# Altium schematic sheet power.SchDoc
size Letter
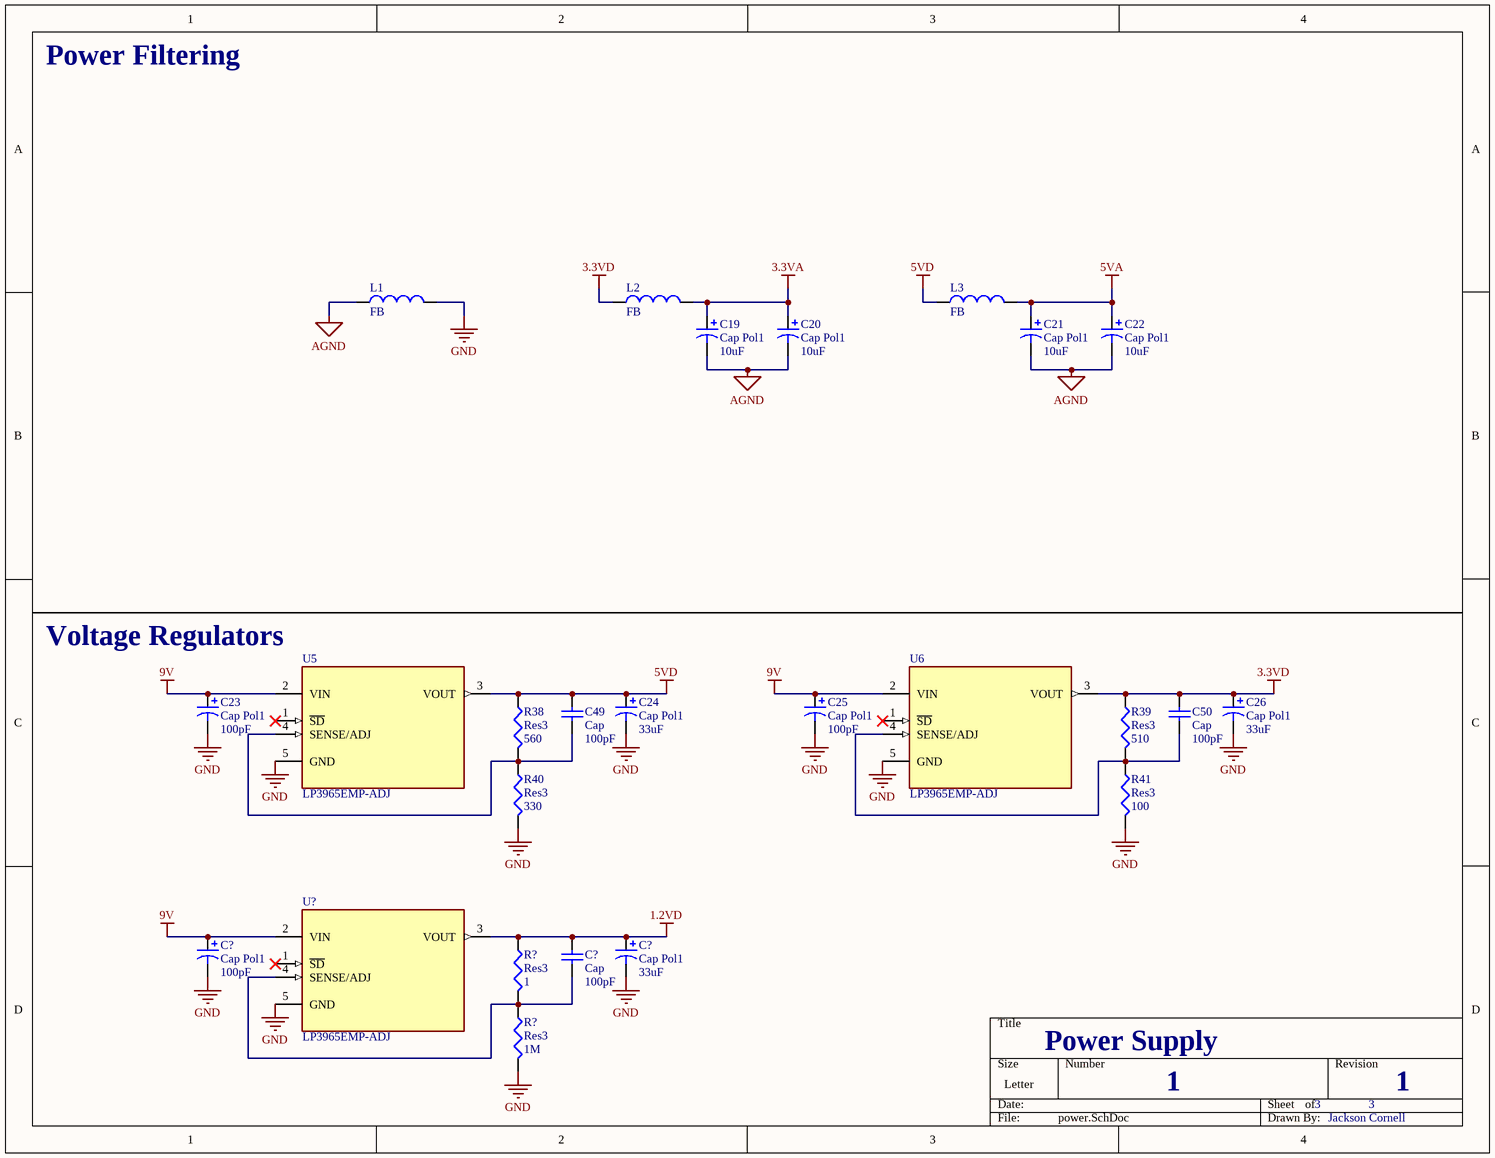
[diagram p0: power.SchDoc]

## Parts
(Parts that share a designator on the sheet are numbered #1, #2 ... from top to bottom, then left to right.)
C19  Cap Pol1  value 10uF  [RB7.6-15]
C20  Cap Pol1  value 10uF  [RB7.6-15]
C21  Cap Pol1  value 10uF  [RB7.6-15]
C22  Cap Pol1  value 10uF  [RB7.6-15]
C23  Cap Pol1  value 100pF  [RB7.6-15]
C24  Cap Pol1  value 33uF  [RB7.6-15]
C25  Cap Pol1  value 100pF  [RB7.6-15]
C26  Cap Pol1  value 33uF  [RB7.6-15]
C49  Cap  value 100pF  [CAPC0805]
C50  Cap  value 100pF  [CAPC0805]
C?#1  Cap Pol1  value 100pF  [RB7.6-15]
C?#2  Cap Pol1  value 33uF  [RB7.6-15]
C?#3  Cap  value 100pF  [CAPC0805]
L1  FB  [0402-A]
L2  FB  [0402-A]
L3  FB  [0402-A]
R38  Res3  value 560  [RES0805]
R39  Res3  value 510  [RES0805]
R40  Res3  value 330  [RES0805]
R41  Res3  value 100  [RES0805]
R?#1  Res3  value 1  [RES0805]
R?#2  Res3  value 1M  [RES0805]
U5  LP3965EMP-ADJ  [SOT150P696X180-5N]
U6  LP3965EMP-ADJ  [SOT150P696X180-5N]
U?  LP3965EMP-ADJ  [SOT150P696X180-5N]

## Nets
1.2VD: C?#2.1 C?#3.2 R?#1.1 U?.3(VOUT)
3.3VA: C19.1 C20.1 L2.2
3.3VD: C26.1 C50.2 L2.1 R39.1 U6.3(VOUT)
5VA: C21.1 C22.1 L3.2
5VD: C24.1 C49.2 L3.1 R38.1 U5.3(VOUT)
9V: C23.1 C25.1 C?#1.1 U5.2(VIN) U6.2(VIN) U?.2(VIN)
AGND: C19.2 C20.2 C21.2 C22.2 L1.1
GND: C23.2 C24.2 C25.2 C26.2 C?#1.2 C?#2.2 L1.2 R40.2 R41.2 R?#2.2 U5.5(GND) U6.5(GND) U?.5(GND)
NetC49_1: C49.1 R38.2 R40.1 U5.4(SENSE/ADJ)
NetC50_1: C50.1 R39.2 R41.1 U6.4(SENSE/ADJ)
NetC?#3_1: C?#3.1 R?#1.2 R?#2.1 U?.4(SENSE/ADJ)

Not connected (* = marked no-connect by the designer): U5 1(~{SD})*; U6 1(~{SD})*; U? 1(~{SD})*

## Notes on the sheet
- Power Filtering
- Voltage Regulators
- Power Supply
- 1
- 3
- Jackson Cornell

## Library data of the parts
C19-C26 C?#1 C?#2 = Cap Pol1: Polarized Capacitor (Radial); Published: 8-Jun-2000; LatestRevisionDate: 17-Jul-2002; LatestRevisionNote: Re-released for DXP Platform.; PackageReference: RB7.6-15; Publisher: Altium Limited; PackageDescription: Polarized Capacitor (Radial); 2 Leads
C49 C50 C?#3 = Cap: Capacitor; Published: 8-Jun-2000; LatestRevisionDate: 17-Jul-2002; LatestRevisionNote: Re-released for DXP Platform.; PackageReference: RAD-0.3; Publisher: Altium Limited; PackageDescription: Radial Cap, Thru-Hole; 2 Leads; 0.3 in Pin Spacing
L1-L3 = Inductor: Code_IEC: 1005; Published: 8-Jun-2000; LatestRevisionDate: 29-May-2009; LatestRevisionNote: IPC-7351 Footprint Added.; PackageReference: 0402-A; Publisher: Altium Limited; PackageDescription: Chip Inductor; Code_JEITA: 0402
R38-R41 R?#1 R?#2 = Res3: Resistor; Published: 8-Jun-2000; LatestRevisionDate: 29-May-2009; LatestRevisionNote: IPC-7351 Footprint Added.; PackageReference: J1-0603; Publisher: Altium Limited; PackageDescription: Chip Resistor
U5 U6 U? = LP3965EMP-ADJ: Fast Ultra Low Dropout Linear Regulators; Package: None; Price: None; Value: *; MP: LP3965EMP-ADJ; Availability: Unavailable